# Altium schematic sheet Sheet.SchDoc
size A; SheetNumber: 1; SheetTotal: 1
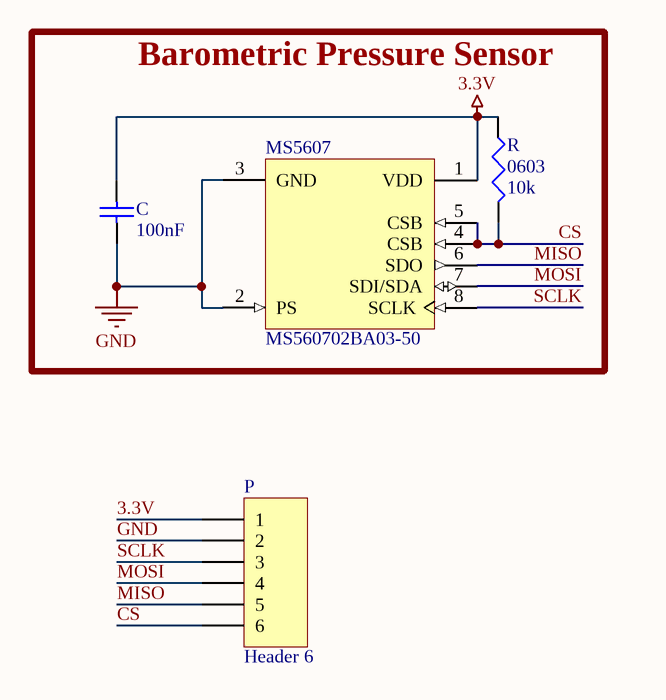
[diagram p0: Sheet.SchDoc]

## Parts
C  100nF  [CAPC1608X95X40ML15T15]
MS5607  MS560702BA03-50  [TECO-MS560702BA03-50_V]
P  Header 6  [HDR1X6]
R  0603  value 10k  [J1-0603]

## Blocks framed on the sheet
Barometric Pressure Sensor: C MS5607 R

## Nets
3.3V: C.2 MS5607.1(VDD) P.1 R.1
GND: C.1 MS5607.2(PS) MS5607.3(GND) P.2
CS: MS5607.4(CSB) MS5607.5(CSB) P.6 R.2
MISO: MS5607.6(SDO) P.5
MOSI: MS5607.7(SDI/SDA) P.4
SCLK: MS5607.8(SCLK) P.3

## Library data of the parts
C = CMP-2006-01550-1: Manufacturer: Vitramon; Part Number: VJ0603Y104KXQCW1BC
MS5607 = CMP-2000-07512-1: Barometric Pressure Sensor, with Stainless Steel Cap , 1.8 to 3.6 V, -40 to 85 degC, 8-Pin SMD, RoHS, Tape and Reel; Manufacturer: TE Connectivity; Lead Free: LeadFree; RoHSCompliant: false; Mounting Technology: SurfaceMount; Datasheet URL: http://www.te.com/commerce/DocumentDelivery/DDEController?Action=showdoc&DocId=Data+Sheet%7FMS5607-02BA03%7FB2%7Fpdf%7FEnglish%7FENG_DS_MS5607-02BA03_B2.pdf%7FMS560702BA03-50; Manufacturer URL: http://www.te.com/; Package Description: 8-Pin Surface Mount Device, Body 3 x 5 mm, Pitch 1.25 mm; Package Reference: MS560702BA03-50; Datasheet Version: 06/2017
P = Header 6: Header, 6-Pin; LatestRevisionDate: 17-Jul-2002; LatestRevisionNote: Re-released for DXP Platform.; Publisher: Altium Limited
R = Res3: Resistor; Published: 8-Jun-2000; LatestRevisionDate: 29-May-2009; LatestRevisionNote: IPC-7351 Footprint Added.; PackageReference: J1-0603; Publisher: Altium Limited; PackageDescription: Chip Resistor